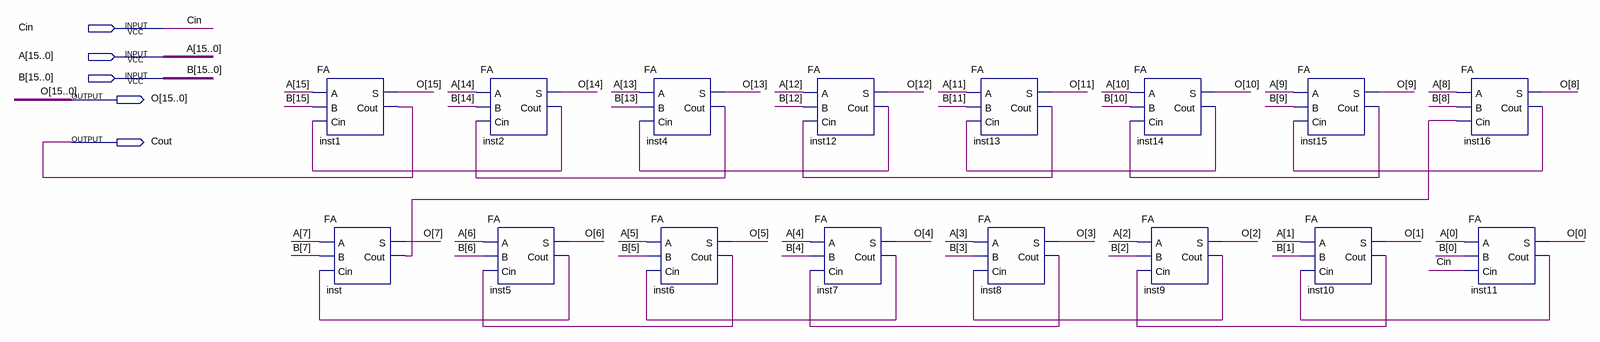
[diagram p0: schematic sheet]
// Quartus schematic FA16B2.bdf as structural Verilog: 16 symbols, 5 pins
module FA16B2 (
  input  Cin,
  input  [15:0] A,
  input  [15:0] B,
  output [15:0] O,
  output Cout
);

  wire inst2_cout, inst4_cout, inst5_cout, inst6_cout, inst7_cout, inst8_cout, inst9_cout, inst10_cout,
       inst11_cout, inst12_cout, inst13_cout, inst14_cout, inst15_cout, inst16_cout, inst_cout;

  FA inst1 (.A(A[15]), .B(B[15]), .Cin(inst2_cout), .S(O[15]), .Cout(Cout));
  FA inst (.A(A[7]), .B(B[7]), .Cin(inst5_cout), .S(O[7]), .Cout(inst_cout));
  FA inst2 (.A(A[14]), .B(B[14]), .Cin(inst4_cout), .S(O[14]), .Cout(inst2_cout));
  FA inst5 (.A(A[6]), .B(B[6]), .Cin(inst6_cout), .S(O[6]), .Cout(inst5_cout));
  FA inst4 (.A(A[13]), .B(B[13]), .Cin(inst12_cout), .S(O[13]), .Cout(inst4_cout));
  FA inst6 (.A(A[5]), .B(B[5]), .Cin(inst7_cout), .S(O[5]), .Cout(inst6_cout));
  FA inst12 (.A(A[12]), .B(B[12]), .Cin(inst13_cout), .S(O[12]), .Cout(inst12_cout));
  FA inst7 (.A(A[4]), .B(B[4]), .Cin(inst8_cout), .S(O[4]), .Cout(inst7_cout));
  FA inst13 (.A(A[11]), .B(B[11]), .Cin(inst14_cout), .S(O[11]), .Cout(inst13_cout));
  FA inst8 (.A(A[3]), .B(B[3]), .Cin(inst9_cout), .S(O[3]), .Cout(inst8_cout));
  FA inst14 (.A(A[10]), .B(B[10]), .Cin(inst15_cout), .S(O[10]), .Cout(inst14_cout));
  FA inst9 (.A(A[2]), .B(B[2]), .Cin(inst10_cout), .S(O[2]), .Cout(inst9_cout));
  FA inst15 (.A(A[9]), .B(B[9]), .Cin(inst16_cout), .S(O[9]), .Cout(inst15_cout));
  FA inst10 (.A(A[1]), .B(B[1]), .Cin(inst11_cout), .S(O[1]), .Cout(inst10_cout));
  FA inst16 (.A(A[8]), .B(B[8]), .Cin(inst_cout), .S(O[8]), .Cout(inst16_cout));
  FA inst11 (.A(A[0]), .B(B[0]), .Cin(Cin), .S(O[0]), .Cout(inst11_cout));
endmodule
